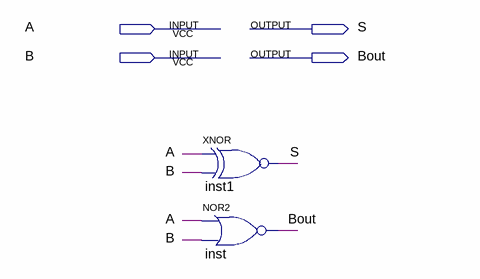
[diagram p0: schematic sheet]
// Quartus schematic HD.bdf as structural Verilog: 2 symbols, 4 pins
module HD (
  input  A,
  input  B,
  output S,
  output Bout
);

  xnor inst1 (S, A, B);
  nor inst (Bout, A, B);
endmodule
